# Altium schematic sheet ESP-12(E).SchDoc
size A4
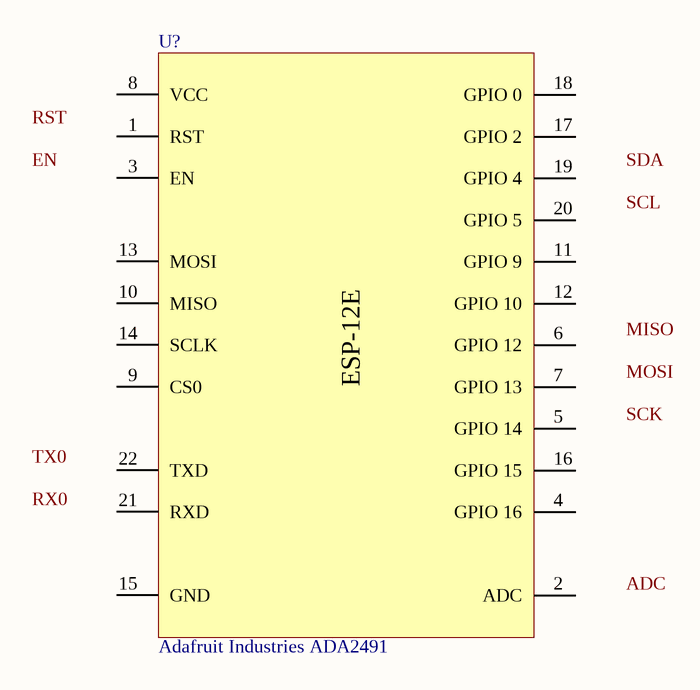
[diagram p0: ESP-12(E).SchDoc]

## Parts
U?  Adafruit Industries ADA2491  [ESP-12E]

## Nets

Not connected (* = marked no-connect by the designer): U? 1(RST) 2(ADC) 3(EN) 4(GPIO_16) 5(GPIO_14) 6(GPIO_12) 7(GPIO_13) 8(VCC) 9(CS0) 10(MISO) 11(GPIO_9) 12(GPIO_10) 13(MOSI) 14(SCLK) 15(GND) 16(GPIO_15) 17(GPIO_2) 18(GPIO_0) 19(GPIO_4) 20(GPIO_5) 21(RXD) 22(TXD)

## Notes on the sheet
- Labels drawn without touching a wire or pin: ADC, EN, MISO, MOSI, RST, RX0, SCK, SCL, SDA, TX0

## Library data of the parts
U? = CMP-2c9ce6e9266cf35b-2: ESP8266 SMT Module; OctopartID: 2c9ce6e9266cf35b; Manufacturer Part Number: ESP-12E; Octopart URL: http://octopart.com/ada2491-adafruit+industries-58666902